# EAGLE design biochem (EAGLE 9.6.2)
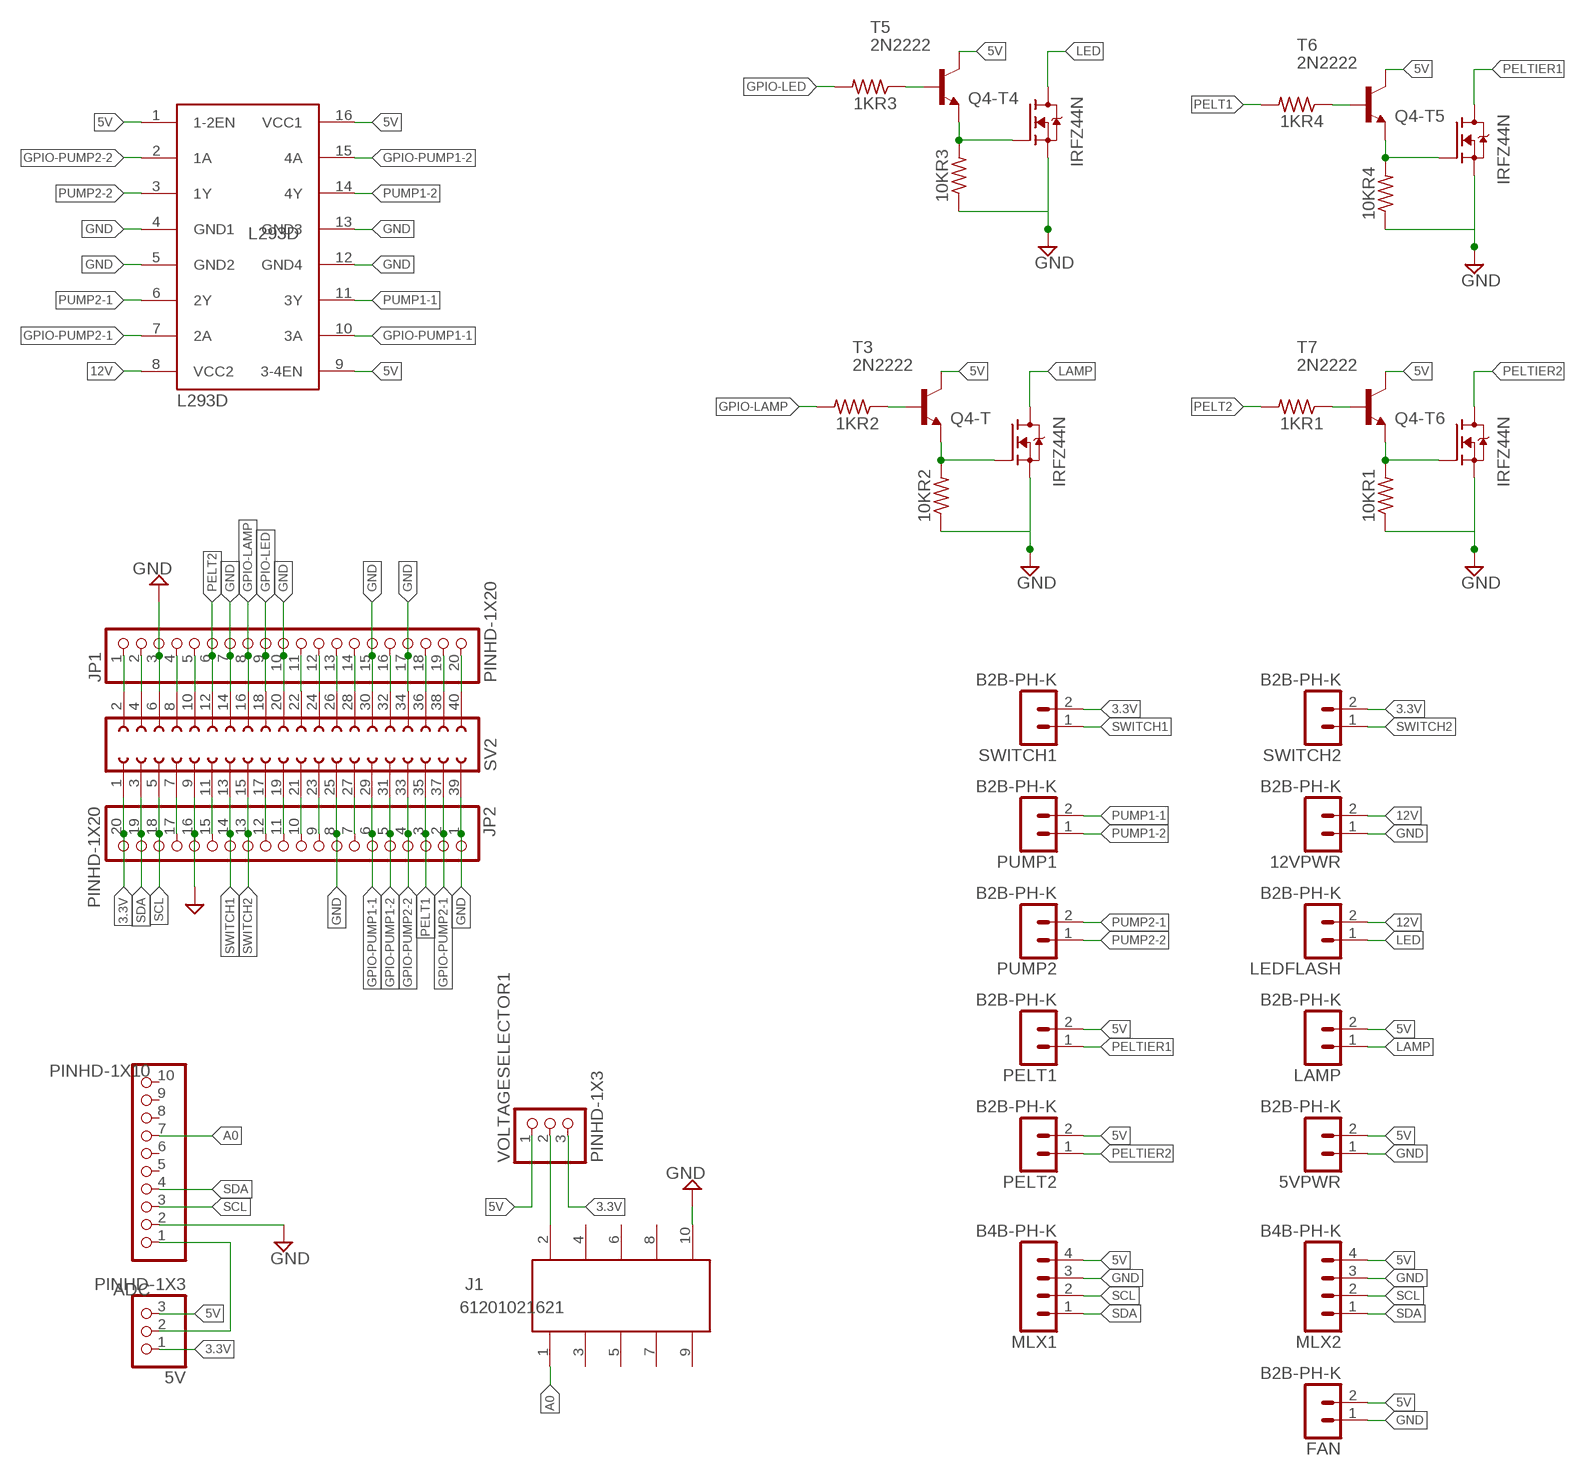
[diagram p0: schematic, sheet 1]

## Parts
1KR1  R-US_0204/7  [0204/7]
1KR2  R-US_0204/7  [0204/7]
1KR3  R-US_0204/7  [0204/7]
1KR4  R-US_0204/7  [0204/7]
5V  PINHD-1X3  [1X03]
5VPWR  B2B-PH-K  [B2B-PH-K]
10KR1  R-US_0204/7  [0204/7]
10KR2  R-US_0204/7  [0204/7]
10KR3  R-US_0204/7  [0204/7]
10KR4  R-US_0204/7  [0204/7]
12VPWR  B2B-PH-K  [B2B-PH-K]
ADC  PINHD-1X10  [1X10]
FAN  B2B-PH-K  [B2B-PH-K]
J1  61201021621  [61201021621]
JP1  PINHD-1X20  [1X20]
JP2  PINHD-1X20  [1X20]
L293D  L293D  [DIL16]
LAMP  B2B-PH-K  [B2B-PH-K]
LEDFLASH  B2B-PH-K  [B2B-PH-K]
MLX1  B4B-PH-K  [B4B-PH-K]
MLX2  B4B-PH-K  [B4B-PH-K]
PELT1  B2B-PH-K  [B2B-PH-K]
PELT2  B2B-PH-K  [B2B-PH-K]
PUMP1  B2B-PH-K  [B2B-PH-K]
PUMP2  B2B-PH-K  [B2B-PH-K]
Q4-T  IRFZ44N  [TO254P1016X419X2286-3]
Q4-T4  IRFZ44N  [TO254P1016X419X2286-3]
Q4-T5  IRFZ44N  [TO254P1016X419X2286-3]
Q4-T6  IRFZ44N  [TO254P1016X419X2286-3]
SV2  FE20-2  [FE20-2]
SWITCH1  B2B-PH-K  [B2B-PH-K]
SWITCH2  B2B-PH-K  [B2B-PH-K]
T3  2N2222  [TO92-EBC-OVAL]
T5  2N2222  [TO92-EBC-OVAL]
T6  2N2222  [TO92-EBC-OVAL]
T7  2N2222  [TO92-EBC-OVAL]
VOLTAGESELECTOR1  PINHD-1X3  [1X03]

## Nets
3.3V: 5V.1 JP2.20 SV2.1 SWITCH1.2 SWITCH2.2 VOLTAGESELECTOR1.3
5V: 5V.3 5VPWR.2 FAN.2 L293D.1(1-2EN) L293D.9(3-4EN) L293D.16(VCC1) LAMP.2 MLX1.4 MLX2.4 PELT1.2 PELT2.2 T3.C T5.C T6.C T7.C VOLTAGESELECTOR1.1
12V: 12VPWR.2 L293D.8(VCC2) LEDFLASH.2
A0: ADC.7 J1.1
ENCODERSIG: JP2.17 SV2.7
GND: 5VPWR.1 10KR1.1 10KR2.1 10KR3.1 10KR4.1 12VPWR.1 ADC.2 FAN.1 J1.10 JP1.3 JP1.7 JP1.10 JP1.15 JP1.17 JP2.1 JP2.8 JP2.16 L293D.4(GND1) L293D.5(GND2) L293D.12(GND4) L293D.13(GND3) MLX1.3 MLX2.3 Q4-T4.3(S) Q4-T5.3(S) Q4-T6.3(S) Q4-T.3(S) SV2.6 SV2.9 SV2.14 SV2.20 SV2.25 SV2.30 SV2.34 SV2.39
GPIO-LAMP: 1KR2.2 JP1.8 SV2.16
GPIO-LED: 1KR3.2 JP1.9 SV2.18
GPIO-PUMP1-1: JP2.6 L293D.10(3A) SV2.29
GPIO-PUMP1-2: JP2.5 L293D.15(4A) SV2.31
GPIO-PUMP2-1: JP2.2 L293D.7(2A) SV2.37
GPIO-PUMP2-2: JP2.4 L293D.2(1A) SV2.33
LAMP: LAMP.1 Q4-T.2(D)
LED: LEDFLASH.1 Q4-T4.2(D)
M0: JP1.11 SV2.22
M1: JP1.12 SV2.24
M2: JP1.13 SV2.26
N$1: JP1.1 SV2.2
N$2: JP1.2 SV2.4
N$3: JP1.4 SV2.8
N$4: 10KR2.2 Q4-T.1(G) T3.E
N$5: 1KR2.1 T3.B
N$6: JP1.5 SV2.10
N$8: J1.2 VOLTAGESELECTOR1.2
N$10: 5V.2 ADC.1
N$11: 10KR3.2 Q4-T4.1(G) T5.E
N$12: 1KR3.1 T5.B
N$14: 10KR4.2 Q4-T5.1(G) T6.E
N$15: 1KR4.1 T6.B
N$16: 10KR1.2 Q4-T6.1(G) T7.E
N$17: 1KR1.1 T7.B
N$18: JP1.14 SV2.28
N$20: JP1.16 SV2.32
N$26: JP2.7 SV2.27
N$28: JP2.9 SV2.23
N$29: JP2.10 SV2.21
N$30: JP2.11 SV2.19
N$31: JP2.12 SV2.17
PELT1: 1KR4.2 JP2.3 SV2.35
PELT2: 1KR1.2 JP1.6 SV2.12
PELTIER1: PELT1.1 Q4-T5.2(D)
PELTIER2: PELT2.1 Q4-T6.2(D)
PUMP1-1: L293D.11(3Y) PUMP1.2
PUMP1-2: L293D.14(4Y) PUMP1.1
PUMP2-1: L293D.6(2Y) PUMP2.2
PUMP2-2: L293D.3(1Y) PUMP2.1
SCL: ADC.3 JP2.18 MLX1.2 MLX2.2 SV2.5
SDA: ADC.4 JP2.19 MLX1.1 MLX2.1 SV2.3
STEPDIR: JP1.18 SV2.36
STEPRST: JP2.15 SV2.11
STEPSLP: JP1.20 SV2.40
STEPSTP: JP1.19 SV2.38
SWITCH1: JP2.14 SV2.13 SWITCH1.1
SWITCH2: JP2.13 SV2.15 SWITCH2.1
Unconnected: ADC.5 ADC.6 ADC.8 ADC.9 ADC.10 J1.3 J1.4 J1.5 J1.6 J1.7 J1.8 J1.9

## Library data of the parts
1KR1-1KR4 10KR1-10KR4 = rcl:R-US_: RESISTOR, American symbol; SPICEPREFIX: R
5V VOLTAGESELECTOR1 = Connector:PINHD-1X3: PIN HEADER; CATEGORY: CONNECTOR; SUB-CATEGORY: PIN-HEADER
5VPWR 12VPWR FAN LAMP LEDFLASH PELT1 PELT2 PUMP1 PUMP2 SWITCH1 SWITCH2 = B2B-PH-K:B2B-PH-K: HEADER Check availability <https://pricing.snapeda.com/parts/B2B-PH-K/JST%20Corporation/view-part?ref=eda>; AVAILABILITY: In Stock; DESCRIPTION: Conn Shrouded Header HDR 2 POS 2mm Solder ST Thru-Hole Box; MF: JST Corporation; MP: B2B-PH-K; PACKAGE: None; PRICE: None; PURCHASE-URL: https://pricing.snapeda.com/search/part/B2B-PH-K/?ref=eda
ADC = Connector:PINHD-1X10: PIN HEADER; CATEGORY: CONNECTOR; SUB-CATEGORY: PIN-HEADER
J1 = 61201021621:61201021621: WR-BHD 2.54mm Male Box Header, 10 Pins=>Code : Con_WTB_BHD_2.54_Male_THT_WS_61201021621 <http://katalog.we-online.de/media/thumbs2/eican/thb_Con_WTB_BHD_2.54_Male_THT_WS_6120xx21621_pf2.jpg> Details see: http://katalog.we-online.de/en/em/612_0xx_216_21 Created 2014-06-04, Karrer Zheng 2014 (C) Würth Elektronik Check availability <https://pricing.snapeda.com/parts/61201021621/Wurth%20Elektronik/view-part?ref=eda>; AVAILABILITY: In Stock; DESCRIPTION: Connector Header Through Hole 10 position 0.100 (2.54mm); MF: Wurth Elektronik; MP: 61201021621; PACKAGE: None; PRICE: None; PURCHASE-URL: https://pricing.snapeda.com/search/part/61201021621/?ref=eda
JP1 JP2 = Connector:PINHD-1X20: PIN HEADER; CATEGORY: CONNECTOR; SUB-CATEGORY: PIN-HEADER
L293D = st-microelectronics:L293D: PUSH-PULL 4 CHANNEL DRIVER; MPN: L293D; OC_FARNELL: 9589619; OC_NEWARK: 56P8249
MLX1 MLX2 = B2B-PH-K:B4B-PH-K
Q4-T Q4-T4-Q4-T6 = IRFZ44N:IRFZ44N: Check availability <https://pricing.snapeda.com/parts/IRFZ44N/Infineon%20Technologies/view-part?ref=eda>; AVAILABILITY: In Stock; DESCRIPTION: N-Channel 55 V 49A (Tc) 94W (Tc) Through Hole TO-220AB; MF: Infineon Technologies; MP: IRFZ44N; PACKAGE: TO-220-3 Infineon; PRICE: None; PURCHASE-URL: https://pricing.snapeda.com/search/part/IRFZ44N/?ref=eda
SV2 = con-lsta:FE20-2: FEMALE HEADER; OC_FARNELL: unknown; OC_NEWARK: unknown
T3 T5-T7 = adafruit:2N2222: NPN TRANSISTOR Big oval pads

## Board
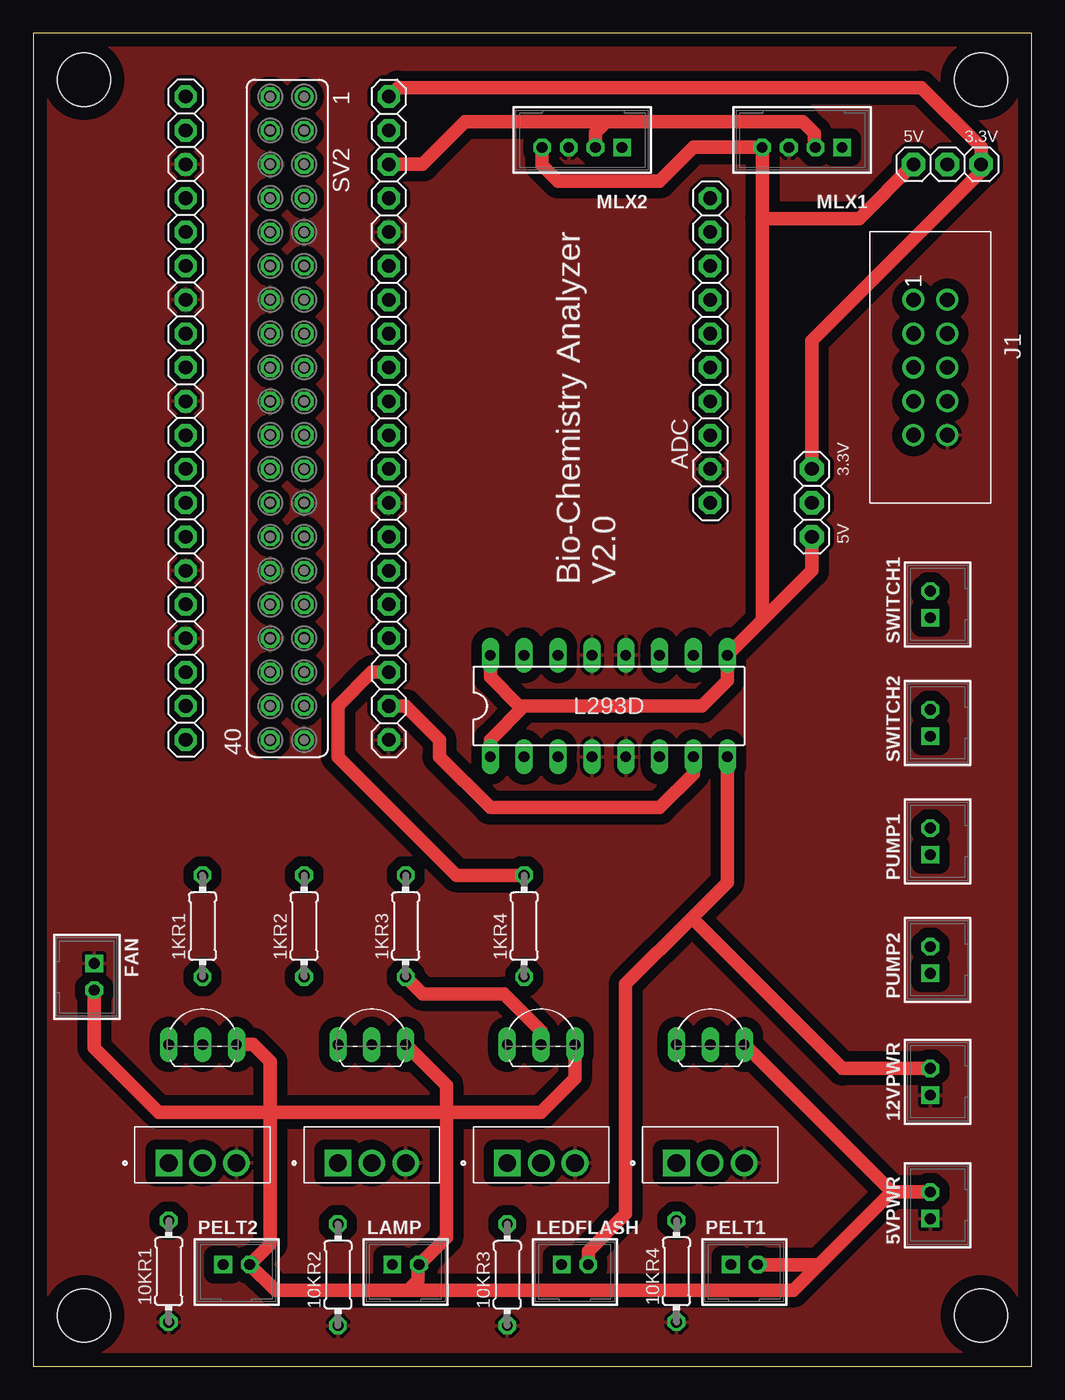
[diagram p1: board, top side]
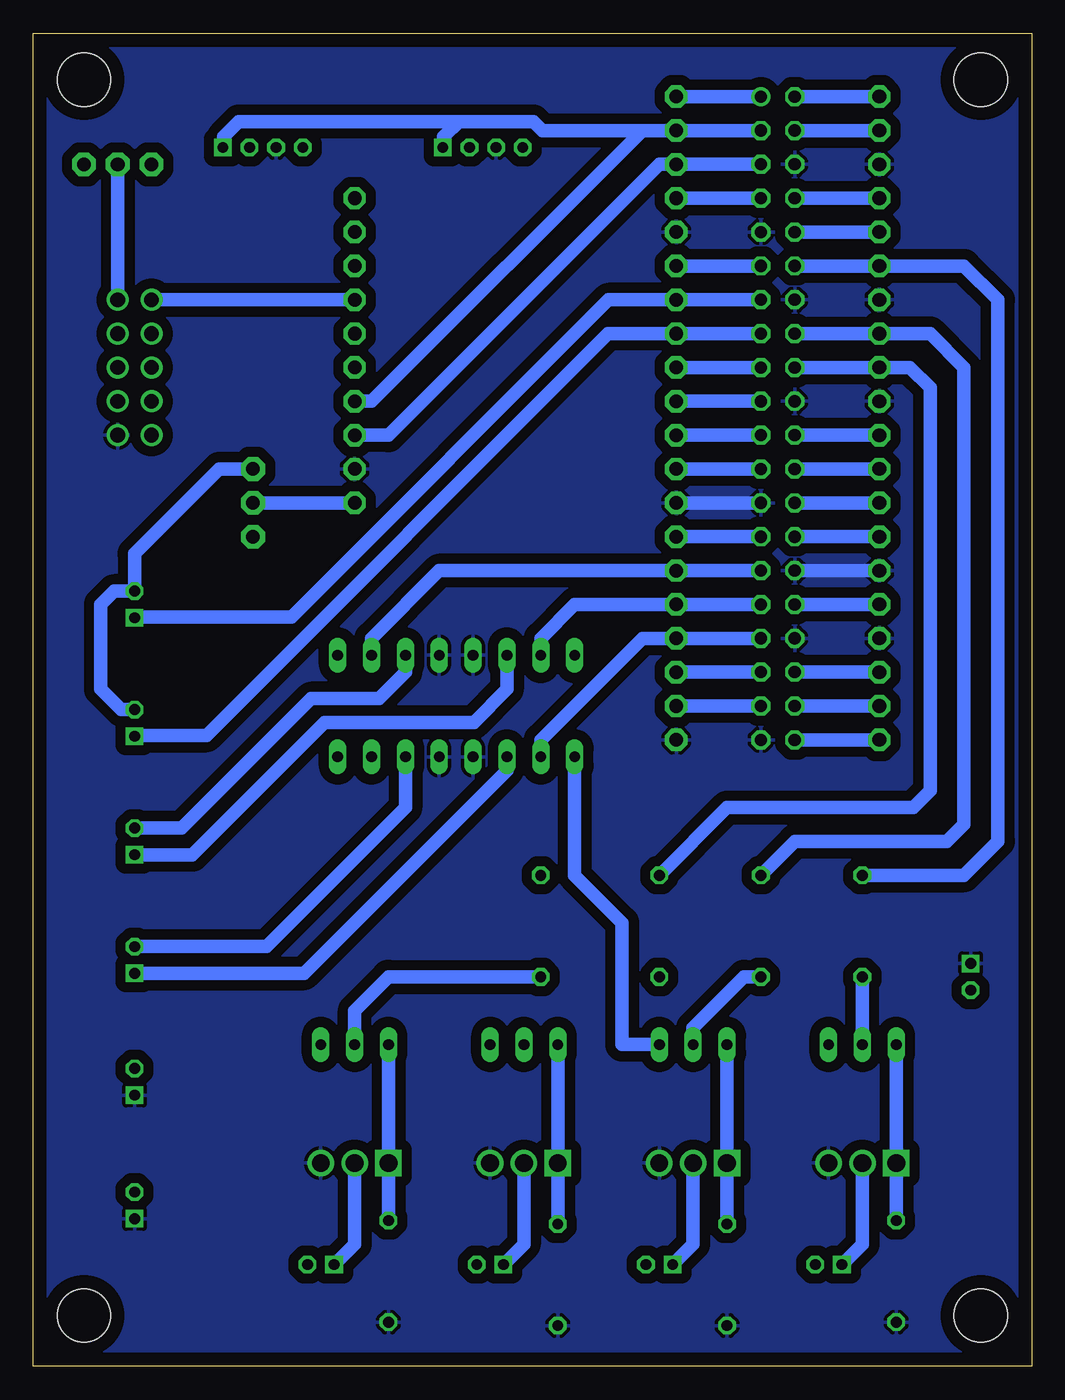
[diagram p2: board, bottom side, seen from below]

Size 74.91 x 100 mm. Coordinates in mm from the lower left corner, seen from the top.
Outline: 0,0 74.91,0 74.91,100 0,100 0,0
Copper layers (1*16): Top 0.035mm / dielectric 1.5mm / Bottom 0.035mm
Design rules "default *": minimum track width 40mil, minimum drill 0.35mm, track to track 30mil, track to pad 30mil, pad to pad 6mil, via to via 6mil, smd to smd 6mil, copper to edge 40mil, drill to drill 6mil, minimum pad ring 10mil, minimum via ring 8mil, stop-mask expansion 4mil, vias tented up to drill 0mil, thermal gap 10mil
Holes 4 mm at 3.81,96.52 3.81,3.81 71.12,3.81 71.12,96.52

### Footprints (pad centres in the part's own frame; a part is rotated, then mirrored left to right if it is on the bottom)
0204/7 = drill 0.813 octagon: 1 -3.81,0; 2 3.81,0
1X03 = drill 1.016 pad 1.778 octagon: 1 -2.54,0; 2 0,0; 3 2.54,0
B2B-PH-K = drill 0.813 square: 1 -1,0 | drill 0.813 octagon: 2 1,0
1X10 = drill 1.016 pad 1.676 octagon: 1 -11.43,0; 2 -8.89,0; 3 -6.35,0; 4 -3.81,0; 5 -1.27,0; 6 1.27,0; 7 3.81,0; 8 6.35,0; 9 8.89,0; 10 11.43,0
61201021621 = drill 1.1: 1 -5.08,-1.27; 2 -5.08,1.27; 3 -2.54,-1.27; 4 -2.54,1.27; 5 0,-1.27; 6 0,1.27; 7 2.54,-1.27; 8 2.54,1.27; 9 5.08,-1.27; 10 5.08,1.27
1X20 = drill 1.016 pad 1.676 octagon: 1 -24.13,0; 2 -21.59,0; 3 -19.05,0; 4 -16.51,0; 5 -13.97,0; 6 -11.43,0; 7 -8.89,0; 8 -6.35,0; 9 -3.81,0; 10 -1.27,0; 11 1.27,0; 12 3.81,0; 13 6.35,0; 14 8.89,0; 15 11.43,0; 16 13.97,0; 17 16.51,0; 18 19.05,0; 19 21.59,0; 20 24.13,0
DIL16 = drill 0.813 long: 1 -8.89,-3.81; 2 -6.35,-3.81; 3 -3.81,-3.81; 4 -1.27,-3.81; 5 1.27,-3.81; 6 3.81,-3.81; 7 6.35,-3.81; 8 8.89,-3.81; 9 8.89,3.81; 10 6.35,3.81; 11 3.81,3.81; 12 1.27,3.81; 13 -1.27,3.81; 14 -3.81,3.81; 15 -6.35,3.81; 16 -8.89,3.81
B4B-PH-K = drill 0.813 square: 1 -1,0 | drill 0.813 octagon: 2 1,0; 3 3,0; 4 5,0
TO254P1016X419X2286-3 = drill 1.33 square: 1 -2.54,0 | drill 1.33: 2 0,0; 3 2.54,0
FE20-2 = drill 0.914: 1 -24.13,1.27 | drill 0.914 octagon: 2 -24.13,-1.27; 3 -21.59,1.27; 4 -21.59,-1.27; 5 -19.05,1.27; 6 -19.05,-1.27; 7 -16.51,1.27; 8 -16.51,-1.27; 9 -13.97,1.27; 10 -13.97,-1.27; 11 -11.43,1.27; 12 -11.43,-1.27; 13 -8.89,1.27; 14 -8.89,-1.27; 15 -6.35,1.27; 16 -6.35,-1.27; 17 -3.81,1.27; 18 -3.81,-1.27; 19 -1.27,1.27; 20 -1.27,-1.27; 21 1.27,1.27; 22 1.27,-1.27; 23 3.81,1.27; 24 3.81,-1.27; 25 6.35,1.27; 26 6.35,-1.27; 27 8.89,1.27; 28 8.89,-1.27; 29 11.43,1.27; 30 11.43,-1.27; 31 13.97,1.27; 32 13.97,-1.27; 33 16.51,1.27; 34 16.51,-1.27; 35 19.05,1.27; 36 19.05,-1.27; 37 21.59,1.27; 38 21.59,-1.27; 39 24.13,1.27; 40 24.13,-1.27
TO92-EBC-OVAL = drill 0.813 long: B 0,-1.27; C 2.54,-1.27; E -2.54,-1.27

### Placement (x,y rotation side)
1KR1  12.7,33.02 90 top
1KR2  20.32,33.02 90 top
1KR3  27.94,33.02 90 top
1KR4  36.83,33.02 90 top
5V  58.42,64.77 270 top
5VPWR  67.31,12.06 90 top
10KR1  10.16,7.11 90 top
10KR2  22.86,6.86 90 top
10KR3  35.56,6.86 90 top
10KR4  48.26,7.11 90 top
12VPWR  67.31,21.34 90 top
ADC  50.8,76.2 90 top
FAN  4.57,29.21 270 top
J1  67.31,74.93 270 top
JP1  11.43,71.12 270 top
JP2  26.67,71.12 90 top
L293D  43.18,49.53 0 top
LAMP  27.94,7.62 0 top
LEDFLASH  40.64,7.62 0 top
MLX1  59.69,91.44 180 top
MLX2  43.18,91.44 180 top
PELT1  53.34,7.62 0 top
PELT2  15.24,7.62 0 top
PUMP1  67.31,39.37 90 top
PUMP2  67.31,30.48 90 top
Q4-T  25.4,15.24 0 top
Q4-T4  38.1,15.24 0 top
Q4-T5  50.8,15.24 0 top
Q4-T6  12.7,15.24 0 top
SV2  19.05,71.12 270 top
SWITCH1  67.31,57.15 90 top
SWITCH2  67.31,48.26 90 top
T3  25.4,25.4 0 top
T5  38.1,25.4 0 top
T6  50.8,25.4 0 top
T7  12.7,25.4 0 top
VOLTAGESELECTOR1  68.58,90.17 0 top

### Tracks (layer width: path | path; a pad name or v marks a point on that pad's centre or on a via)
3.3V
  Top 1.016: JP2.20 27.36,95.94 66.62,95.94 71.12,91.44 VOLTAGESELECTOR1.3 71.12,89.66 58.42,76.96 5V.1
  Bottom 1.016: SV2.1 JP2.20 | SWITCH2.2 68.31,49.26 69.85,50.8 69.85,57.15 68.85,58.15 SWITCH1.2 67.31,60.96 60.96,67.31 5V.1
5V
  Top 1.016: 36.83,49.53 50.16,49.53 52.07,51.44 L293D.9 54.74,56.01 | 36.83,49.53 36.45,49.53 34.29,51.69 L293D.16 | L293D.1 34.29,46.99 36.83,49.53 | 5V.3 58.42,59.69 54.74,56.01 | MLX2.4 38.18,90.09 39.37,88.9 46.99,88.9 49.53,91.44 MLX1.4 54.69,86.11 | 54.69,86.11 54.69,56.05 54.74,56.01 | VOLTAGESELECTOR1.1 61.98,86.11 54.69,86.11 | T7.C 16.51,24.13 17.78,22.86 17.78,19.05 | 17.78,19.05 17.78,9.16 PELT2.2 18.17,5.69 28.13,5.69 | 28.13,5.69 28.87,6.43 28.87,7.55 LAMP.2 30.99,9.67 30.99,19.05 | T3.C 30.99,21.08 30.99,19.05 | T6.C 64.41,13.06 | 64.41,13.06 5VPWR.2 | 64.41,13.06 58.96,7.62 | 58.96,7.62 PELT1.2 | 28.13,5.69 57.03,5.69 58.96,7.62 | T5.C 40.64,21.59 38.1,19.05 30.99,19.05 | 30.99,19.05 17.78,19.05 | FAN.2 4.57,23.89 9.41,19.05 17.78,19.05
  Bottom 1.016: L293D.1 34.29,36.83 30.73,33.27 30.73,24.13 T3.C
12V
  Top 1.016: LEDFLASH.2 41.64,8.62 44.45,11.43 44.45,28.67 49.42,33.64 | 49.42,33.64 52.07,36.29 L293D.8 | 12VPWR.2 60.72,22.34 49.42,33.64
A0
  Bottom 1.016: J1.1 ADC.7
ENCODERSIG
  Bottom 1.016: JP2.17 SV2.7
GND
  Bottom 1.016: JP2.8 SV2.25 | SV2.30 JP1.15
  pour Top: 0,100.33 0,0 74.93,0 74.93,100.33
  pour Bottom: 0,100.08 0,0 0.25,-0.25 74.68,-0.25 74.93,0 74.93,99.57 74.42,100.08
GPIO-LAMP
  Bottom 1.016: SV2.16 JP1.8 7.62,77.47 5.08,74.93 5.08,40.64 6.35,39.37 17.78,39.37 1KR2.2
GPIO-LED
  Bottom 1.016: 1KR3.2 22.86,41.91 8.89,41.91 7.62,43.18 7.62,73.41 9.14,74.93 JP1.9 SV2.18
GPIO-PUMP1-1
  Bottom 1.016: SV2.29 JP2.6 44.45,59.69 49.53,54.61 L293D.10
GPIO-PUMP1-2
  Bottom 1.016: SV2.31 JP2.5 34.29,57.15 36.83,54.61 L293D.15
GPIO-PUMP2-1
  Top 1.016: JP2.2 27.94,49.53 30.48,46.99 30.48,45.72 34.29,41.91 46.99,41.91 49.53,44.45 L293D.7
  Bottom 1.016: SV2.37 JP2.2
GPIO-PUMP2-2
  Bottom 1.016: SV2.33 JP2.4 29.21,54.61 36.83,46.99 L293D.2
LAMP
  Bottom 1.016: LAMP.1 25.4,9.16 Q4-T.2
LED
  Bottom 1.016: LEDFLASH.1 38.1,9.16 Q4-T4.2
M0
  Bottom 1.016: JP1.11 SV2.22
M1
  Bottom 1.016: SV2.24 JP1.12
M2
  Bottom 1.016: JP1.13 SV2.26
N$1
  Bottom 1.016: JP1.1 SV2.2
N$2
  Bottom 1.016: SV2.4 JP1.2
N$3
  Bottom 1.016: JP1.4 SV2.8
N$4
  Bottom 1.016: T3.E Q4-T.1 10KR2.2
N$5
  Bottom 1.016: T3.B 25.4,25.4 21.59,29.21 1KR2.1
N$6
  Bottom 1.016: SV2.10 JP1.5
N$8
  Bottom 1.016: VOLTAGESELECTOR1.2 J1.2
N$10
  Bottom 1.016: ADC.1 5V.2
N$11
  Bottom 1.016: 10KR3.2 Q4-T4.1 T5.E
N$12
  Top 1.016: 1KR3.1 29.21,27.94 35.31,27.94 38.1,25.15 T5.B
N$14
  Bottom 1.016: T6.E Q4-T5.1 10KR4.2
N$15
  Bottom 1.016: T6.B 50.8,26.67 48.26,29.21 1KR4.1
N$16
  Bottom 1.016: T7.E Q4-T6.1 10KR1.2
N$17
  Bottom 1.016: T7.B 1KR1.1
N$18
  Bottom 1.016: JP1.14 SV2.28
N$20
  Bottom 1.016: JP1.16 SV2.32
N$26
  Bottom 1.016: SV2.27 JP2.7
N$28
  Bottom 1.016: SV2.23 JP2.9
N$29
  Bottom 1.016: JP2.10 SV2.21
N$30
  Bottom 1.016: SV2.19 JP2.11
N$31
  Bottom 1.016: JP2.12 SV2.17
PELT1
  Top 1.016: JP2.3 25.4,52.07 22.86,49.53 22.86,45.72 31.75,36.83 1KR4.2
  Bottom 1.016: SV2.35 JP2.3
PELT2
  Bottom 1.016: SV2.12 JP1.6 5.08,82.55 2.54,80.01 2.54,39.37 5.08,36.83 1KR1.2
PELTIER1
  Bottom 1.016: PELT1.1 50.8,9.16 Q4-T5.2
PELTIER2
  Bottom 1.016: PELT2.1 12.7,9.16 Q4-T6.2
PUMP1-1
  Bottom 1.016: L293D.11 46.99,52.07 48.97,50.09 54.05,50.09 63.77,40.37 PUMP1.2
PUMP1-2
  Bottom 1.016: L293D.14 39.37,50.8 41.86,48.31 53.03,48.31 62.98,38.37 PUMP1.1
PUMP2-1
  Bottom 1.016: L293D.6 46.99,41.91 57.42,31.48 PUMP2.2
PUMP2-2
  Bottom 1.016: L293D.3 39.37,44.7 54.59,29.48 PUMP2.1
SCL
  Top 1.016: MLX2.2 42.18,92.56 42.99,93.37 | 42.99,93.37 57.76,93.37 58.62,92.51 58.62,91.51 MLX1.2 | JP2.18 29.21,90.17 32.41,93.37 42.99,93.37
  Bottom 1.016: SV2.5 JP2.18 27.94,90.17 48.26,69.85 ADC.3
SDA
  Bottom 1.016: JP2.19 SV2.3 | JP2.19 29.21,92.71 49.53,72.39 ADC.4 | JP2.19 36.72,92.71 37.38,93.37 42.98,93.37 | 42.98,93.37 44.11,92.24 44.11,91.51 MLX2.1 | 42.98,93.37 59.49,93.37 60.62,92.24 60.62,91.51 MLX1.1
STEPDIR
  Bottom 1.016: JP1.18 SV2.36
STEPRST
  Bottom 1.016: SV2.11 JP2.15
STEPSLP
  Bottom 1.016: JP1.20 SV2.40
STEPSTP
  Bottom 1.016: SV2.38 JP1.19
SWITCH1
  Bottom 1.016: SV2.13 JP2.14 31.75,80.01 55.54,56.22 67.24,56.22 SWITCH1.1
SWITCH2
  Bottom 1.016: SV2.15 JP2.13 31.78,77.47 61.92,47.33 67.24,47.33 SWITCH2.1

### Text on the board
tNames: 5V | 3.3V | 3.3V | 5V | Bio-Chemistry Analyzer / V2.0